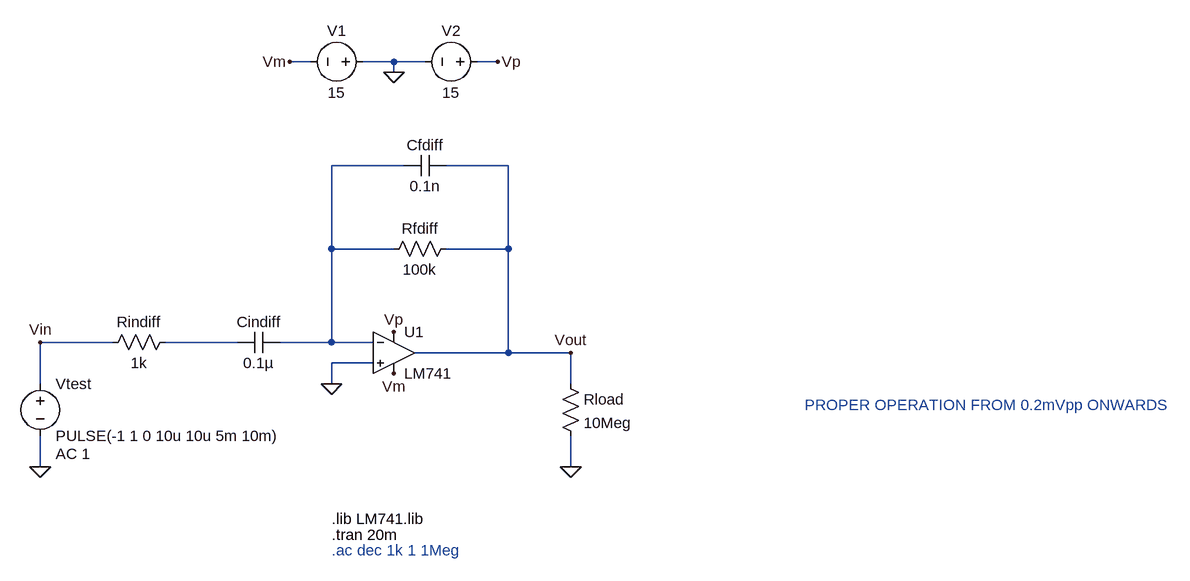
[diagram p0: schematic Differentiator.asc]
Differentiator.asc, the LTspice schematic file:
Version 4
SHEET 1 1400 816
WIRE 80 48 48 48
WIRE 208 48 160 48
WIRE 256 48 208 48
WIRE 368 48 336 48
WIRE 208 64 208 48
WIRE 224 208 112 208
WIRE 384 208 288 208
WIRE 112 336 112 208
WIRE 208 336 112 336
WIRE 384 336 384 208
WIRE 384 336 288 336
WIRE -224 480 -336 480
WIRE -32 480 -144 480
WIRE 112 480 112 336
WIRE 112 480 32 480
WIRE 176 480 112 480
WIRE 384 496 384 336
WIRE 384 496 240 496
WIRE 480 496 384 496
WIRE 176 512 112 512
WIRE -336 544 -336 480
WIRE 112 544 112 512
WIRE 480 544 480 496
WIRE -336 672 -336 624
WIRE 480 672 480 624
FLAG 208 64 0
FLAG 48 48 Vm
FLAG 368 48 Vp
FLAG 208 464 Vp
FLAG 208 528 Vm
FLAG 112 544 0
FLAG 480 672 0
FLAG -336 672 0
FLAG -336 480 Vin
FLAG 480 496 Vout
SYMBOL voltage 176 48 R90
WINDOW 0 -32 56 VBottom 2
WINDOW 3 32 56 VTop 2
WINDOW 123 0 0 Left 0
WINDOW 39 0 0 Left 0
SYMATTR InstName V1
SYMATTR Value 15
SYMBOL voltage 352 48 R90
WINDOW 0 -32 56 VBottom 2
WINDOW 3 32 56 VTop 2
WINDOW 123 0 0 Left 0
WINDOW 39 0 0 Left 0
SYMATTR InstName V2
SYMATTR Value 15
SYMBOL OpAmps\\opamp2 208 432 R0
SYMATTR InstName U1
SYMATTR Value LM741
SYMBOL res 304 320 R90
WINDOW 0 0 56 VBottom 2
WINDOW 3 32 56 VTop 2
SYMATTR InstName Rfdiff
SYMATTR Value 100k
SYMBOL cap 32 464 R90
WINDOW 0 0 32 VBottom 2
WINDOW 3 32 32 VTop 2
SYMATTR InstName Cindiff
SYMATTR Value 0.1µ
SYMBOL res 464 528 R0
SYMATTR InstName Rload
SYMATTR Value 10Meg
SYMBOL voltage -336 528 R0
WINDOW 123 24 124 Left 2
WINDOW 39 0 0 Left 0
SYMATTR Value2 AC 1
SYMATTR InstName Vtest
SYMATTR Value PULSE(-1 1 0 10u 10u 5m 10m)
SYMBOL res -128 464 R90
WINDOW 0 0 56 VBottom 2
WINDOW 3 32 56 VTop 2
SYMATTR InstName Rindiff
SYMATTR Value 1k
SYMBOL cap 288 192 R90
WINDOW 0 0 32 VBottom 2
WINDOW 3 32 32 VTop 2
SYMATTR InstName Cfdiff
SYMATTR Value 0.1n
TEXT 112 752 Left 2 !.lib LM741.lib
TEXT 112 776 Left 2 !.tran 20m
TEXT 112 800 Left 2 ;.ac dec 1k 1 1Meg
TEXT 840 576 Left 2 ;PROPER OPERATION FROM 0.2mVpp ONWARDS

The netlist it stands for:
* Differentiator.asc
V1 0 Vm 15
V2 Vp 0 15
XU1 0 N001 Vp Vm Vout LM741  ; pins In+ In- V+ V- OUT
Rfdiff Vout N001 100k
Cindiff N001 N002 0.1µ
Rload Vout 0 10Meg
Vtest Vin 0 PULSE(-1 1 0 10u 10u 5m 10m) AC 1
Rindiff N002 Vin 1k
Cfdiff Vout N001 0.1n
.lib LM741.lib
.tran 20m
* .ac dec 1k 1 1Meg
* PROPER OPERATION FROM 0.2mVpp ONWARDS
.backanno
.end